# Altium project SealHAT.PrjPcb
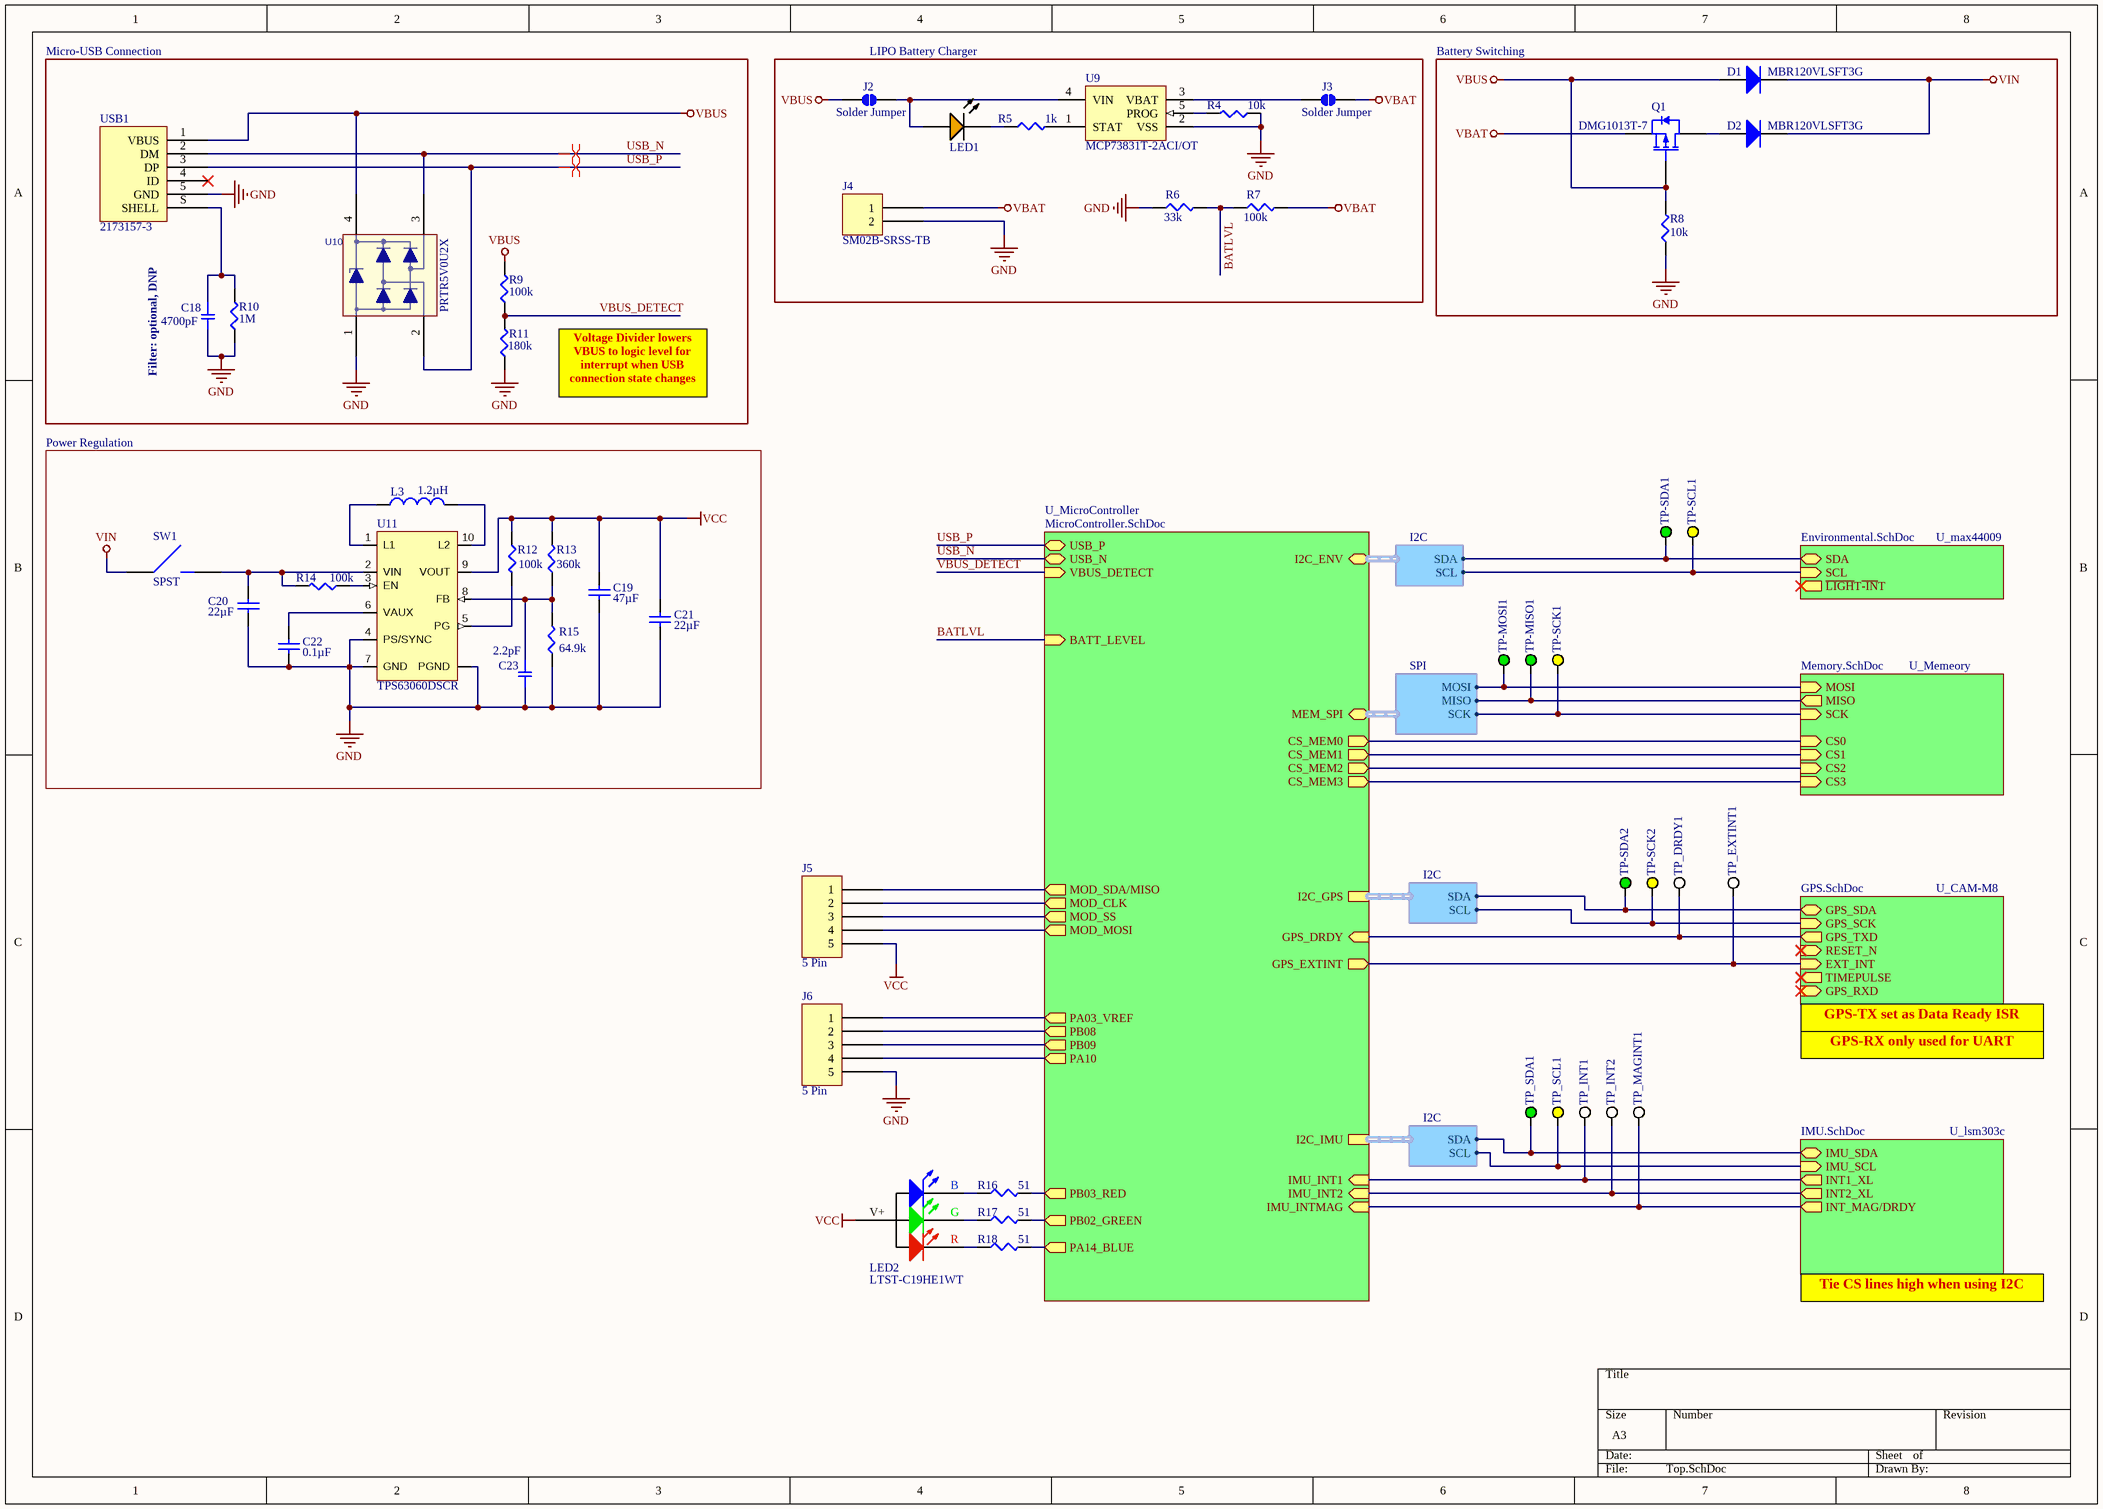
[diagram p0: Top.SchDoc]
6 sheets, 95 parts. Net scope: hierarchical (ports join the sheet entries above them; power ports are global).
Sheets:
  Top.SchDoc
    U_max44009 = Environmental.SchDoc
    U_CAM-M8 = GPS.SchDoc
    U_Memeory = Memory.SchDoc
    U_lsm303c = IMU.SchDoc
    U_MicroController = MicroController.SchDoc

## Sheet Top.SchDoc
size A3

### Parts
C18  value 4700pF  [SMD-0603C]  (hidden comment: GCM188R72A472KA37D)
C19  Capacitance: 47µF  [C0603N]  (hidden comment: CL21A476MQCLRNC)
C20  Capacitance: 22µF  [C0603N]  (hidden comment: CL21A226MQCLQNC)
C21  Capacitance: 22µF  [C0603N]  (hidden comment: CL21A226MQCLQNC)
C22  Capacitance: 0.1µF  [C0603N]  (hidden comment: CL10B104KO8NFNC)
C23  value 2.2pF  [SMD-0603C]  (hidden comment: GRM1885C1H2R2BA01D)
D1  MBR120VLSFT3G  [MBR120VLSFT3G]
D2  MBR120VLSFT3G  [MBR120VLSFT3G]
J2  Solder Jumper  [Jumper_1.5x3]
J3  Solder Jumper  [Jumper_1.5x3]
J4  SM02B-SRSS-TB  [JST SM02B-SRSS-TB]
J5  5 Pin  [PINHEAD127_1x5]
J6  5 Pin  [PINHEAD127_1x5]
L3  Inductance: 1.2µH  [IND_BOURNS_SRP40]  (hidden comment: SRP4020-1R2M)
LED1  LTST-C190KFKT  [LED_0603]  (value not drawn)
LED2  LTST-C19HE1WT  [LED_0606_160X160X35]
Q1  DMG1013T-7  [SOT50P175X90-3N]
R4  value 10k  [SMD-0603-RES]  (hidden comment: ERJ-3EKF1002V)
R5  value 1k  [SMD-0603-RES]  (hidden comment: ERJ-3EKF1001V)
R6  value 33k  [SMD-0603-RES]  (hidden comment: ERJ-3EKF3302V)
R7  value 100k  [SMD-0603-RES]  (hidden comment: ERJ-3EKF1003V)
R8  value 10k  [SMD-0603-RES]  (hidden comment: ERJ-3EKF1002V)
R9  value 100k  [SMD-0603-RES]  (hidden comment: ERJ-3EKF1003V)
R10  value 1M  [SMD-0603-RES]  (hidden comment: ERJ-3EKF1004V)
R11  value 180k  [SMD-0603-RES]  (hidden comment: ERJ-3EKF1803V)
R12  value 100k  [R0603N]  (hidden comment: ERJ-3EKF1003V)
R13  value 360k  [SMD-0603-RES]  (hidden comment: ERJ-3EKF3603V)
R14  value 100k  [R0603N]  (hidden comment: ERJ-3EKF1003V)
R15  value 64.9k  [SMD-0603-RES]  (hidden comment: ERJ-3EKF6492V)
R16  value 51  [SMD-0603-RES]  (hidden comment: ERJ-3EKF51R0V)
R17  value 51  [SMD-0603-RES]  (hidden comment: ERJ-3EKF51R0V)
R18  value 51  [SMD-0603-RES]  (hidden comment: ERJ-3EKF51R0V)
SW1  SPST  [PINHEAD254_1x2]
TP-MISO1  Test Point  [tp_30mil]  (value not drawn)
TP-MOSI1  Test Point  [tp_30mil]  (value not drawn)
TP-SCK1  Test Point  [tp_30mil]  (value not drawn)
TP-SCK2  Test Point  [tp_30mil]  (value not drawn)
TP-SCL1  Test Point  [tp_30mil]  (value not drawn)
TP-SDA1  Test Point  [tp_30mil]  (value not drawn)
TP-SDA2  Test Point  [tp_30mil]  (value not drawn)
TP_DRDY1  Test Point  [tp_30mil]  (value not drawn)
TP_EXTINT1  Test Point  [tp_30mil]  (value not drawn)
TP_INT1  Test Point  [tp_30mil]  (value not drawn)
TP_INT2  Test Point  [tp_30mil]  (value not drawn)
TP_MAGINT1  Test Point  [tp_30mil]  (value not drawn)
TP_SCL1  Test Point  [tp_30mil]  (value not drawn)
TP_SDA1  Test Point  [tp_30mil]  (value not drawn)
U9  MCP73831T-2ACI/OT  [SOT-23-5_MC]
U10  PRTR5V0U2X  [SOT143B]
U11  TPS63060DSCR  [TI_DRC_S-PVSON-N10]
USB1  2173157-3  [CONN_2173157]

### Blocks framed on the sheet
LIPO Battery Charger: J2-J4 LED1 R4-R7 U9
Battery Switching: D1 D2 Q1 R8
Power Regulation: C19-C23 L3 R12-R15 SW1 U11

### Sub-sheets
U_CAM-M8 = GPS.SchDoc: GPS_SCK (in), GPS_SDA (bidir), EXT_INT (in), TIMEPULSE (out), GPS_RXD (in), GPS_TXD (out), RESET_N (in)
U_lsm303c = IMU.SchDoc: IMU_SCL (in), IMU_SDA (bidir), INT1_XL (out), INT_MAG/DRDY (out), INT2_XL (out)
U_max44009 = Environmental.SchDoc: SDA (bidir), SCL (in), ~{LIGH}T~{-IN}T (out)
U_Memeory = Memory.SchDoc: MISO (out), SCK (in), MOSI (in), CS3 (in), CS1 (in), CS2 (in), CS0 (in)
U_MicroController = MicroController.SchDoc: USB_P (bidir), USB_N (bidir), I2C_GPS (harness I2C), VBUS_DETECT (in), BATT_LEVEL (in), GPS_DRDY (in), GPS_EXTINT (out), I2C_IMU (harness I2C), IMU_INT1 (in), IMU_INT2 (in), IMU_INTMAG (in), I2C_ENV (harness I2C), PB03_RED (out), PB02_GREEN (out), MEM_SPI (harness SPI), PA14_BLUE (out), PA10 (out), PA03_VREF (out), MOD_CLK (out), PB08 (out), MOD_MOSI (out), MOD_SS (out), PB09 (out), MOD_SDA/MISO (out), CS_MEM2 (out), CS_MEM1 (out), CS_MEM3 (out), CS_MEM0 (out)

### Harnesses
SPI: MOSI, MISO, SCK
I2C: SCL, SDA

### Nets
GND: C18.2 C19.2 C20.2 C21.2 C22.2 C23.2 J4.2 J6.5 R4.1 R6.1 R8.1 R10.1 R11.1 R15.1 U9.2(VSS) U10.1(GND) U11.4(PS/SYNC) U11.7(GND) U11.11(PGND) USB1.5(GND)
VBAT: J3.2 J4.1 Q1.2(S) R7.2
VBUS: D1.1(A) J2.1 Q1.1(G) R8.2 R9.2 U10.4(VCC) USB1.1(VBUS)
VCC: C19.1 C21.1 J5.5 LED2.4(A) R12.1 R13.2 U11.9(VOUT)
VIN: D1.2(K) D2.2(K) SW1.1
BATLVL: R6.2 R7.1 ; sheet U_MicroController/BATT_LEVEL
MISO: TP-MISO1.1 ; sheet U_Memeory/MISO, sheet U_MicroController/MEM_SPI.MISO
MOSI: TP-MOSI1.1 ; sheet U_Memeory/MOSI, sheet U_MicroController/MEM_SPI.MOSI
PA03_VREFA: J6.1 ; sheet U_MicroController/PA03_VREF
PA04_MOD_SDA: J5.1 ; sheet U_MicroController/MOD_SDA/MISO
PA05_MOD_SCL: J5.2 ; sheet U_MicroController/MOD_CLK
PA06_MOD_SS: J5.3 ; sheet U_MicroController/MOD_SS
PA07_MOD_MOSI: J5.4 ; sheet U_MicroController/MOD_MOSI
PA08_ENV_SDA: TP-SDA1.1 ; sheet U_max44009/SDA, sheet U_MicroController/I2C_ENV.SDA
PA09_ENV_SCL: TP-SCL1.1 ; sheet U_max44009/SCL, sheet U_MicroController/I2C_ENV.SCL
PA10_MOD3: J6.4 ; sheet U_MicroController/PA10
PA11_CSMEM3: sheet U_Memeory/CS3, sheet U_MicroController/CS_MEM3
PA13_MEM_SCK: TP-SCK1.1 ; sheet U_Memeory/SCK, sheet U_MicroController/MEM_SPI.SCK
PA14_CSMEM2: sheet U_Memeory/CS2, sheet U_MicroController/CS_MEM2
PA16_GPS_SDA: TP-SDA2.1 ; sheet U_CAM-M8/GPS_SDA, sheet U_MicroController/I2C_GPS.SDA
PA17_GPS_SCK: TP-SCK2.1 ; sheet U_CAM-M8/GPS_SCK, sheet U_MicroController/I2C_GPS.SCL
PA19_GPS_TXD: TP_DRDY1.1 ; sheet U_CAM-M8/GPS_TXD, sheet U_MicroController/GPS_DRDY
PA20_IMU_INT1: TP_INT1.1 ; sheet U_lsm303c/INT1_XL, sheet U_MicroController/IMU_INT1
PA21_IMU_INT2: TP_INT2.1 ; sheet U_lsm303c/INT2_XL, sheet U_MicroController/IMU_INT2
PA22_IMU_SDA: TP_SDA1.1 ; sheet U_lsm303c/IMU_SDA, sheet U_MicroController/I2C_IMU.SDA
PA23_IMU_SCL: TP_SCL1.1 ; sheet U_lsm303c/IMU_SCL, sheet U_MicroController/I2C_IMU.SCL
PA27_IMU_INTMAG: TP_MAGINT1.1 ; sheet U_lsm303c/INT_MAG/DRDY, sheet U_MicroController/IMU_INTMAG
PB02_GREEN: R17.2 ; sheet U_MicroController/PB02_GREEN
PB03_RED: R16.2 ; sheet U_MicroController/PB03_RED
PB08_MOD1: J6.2 ; sheet U_MicroController/PB08
PB09_MOD2: J6.3 ; sheet U_MicroController/PB09
PB10_CSMEM0: sheet U_Memeory/CS0, sheet U_MicroController/CS_MEM0
PB11_CSMEM1: sheet U_Memeory/CS1, sheet U_MicroController/CS_MEM1
PB22_GPS_EXTINT: TP_EXTINT1.1 ; sheet U_CAM-M8/EXT_INT, sheet U_MicroController/GPS_EXTINT
PB23_BLUE: R18.2 ; sheet U_MicroController/PA14_BLUE
USB_N: U10.3(I/O2) USB1.2(DM) ; sheet U_MicroController/USB_N
USB_P: U10.2(I/O1) USB1.3(DP) ; sheet U_MicroController/USB_P
VBUS_DETECT: R9.1 R11.2 ; sheet U_MicroController/VBUS_DETECT  [project net PA18_VBUS_DETECT]
NetC18_1: C18.1 R10.2 USB1.S(SHELL)
NetC20_1: C20.1 R14.2 SW1.2 U11.2(VIN)
NetC22_1: C22.1 U11.6(VAUX)
NetC23_1: C23.1 R13.1 R15.2 U11.8(FB)
NetD2_1: D2.1(A) Q1.3(D)
NetJ2_2: J2.2 LED1.1(A) U9.4(VIN)
NetJ3_1: J3.1 U9.3(VBAT)
NetL3_1: L3.1 U11.1(L1)
NetL3_2: L3.2 U11.10(L2)
NetLED1_2: LED1.2(K) R5.1
NetLED2_1: LED2.1(R) R18.1
NetLED2_2: LED2.2(G) R17.1
NetLED2_3: LED2.3(B) R16.1
NetR4_2: R4.2 U9.5(PROG)
NetR5_2: R5.2 U9.1(STAT)
NetR12_2: R12.2 U11.5(PG)
NetR14_1: R14.1 U11.3(EN)

Not connected (* = marked no-connect by the designer): USB1 4(ID)*

### Layout directives
differential pair: USB_N, USB_P

### Notes on the sheet
- Micro-USB Connection
- Filter: optional, DNP
- Voltage Divider lowers VBUS to logic level for interrupt when USB connection state changes
- GPS-RX only used for UART
- GPS-TX set as Data Ready ISR
- Tie CS lines high when using I2C
- (in symbol LTST-C19HE1WT) V+

### Library data of the parts
C18 = GCM188R72A472KA37D: CAP CER 4700PF 100V X7R 0603; Manufacturer: Murata Electronics North America; Factory Stock: 0; Unit Price (USD): 0.1; Minimum Quantity: 1; Tolerance: ±10%; Datasheets: http://www.murata.com/~/media/webrenewal/support/library/catalog/products/capacitor/mlcc/c03e.ashx; Image: //media.digikey.com/Renders/Murata%20Renders/0603%28GCM188%29.jpg; Digi-Key Part Number: 490-4930-1-ND; Part Number: GCM188R72A472KA37D; Quantity Available: 3550; @ qty: 0; Packaging: Cut Tape (CT); Series: GCM; Part Status: Active; Voltage: 100V; Temperature Coefficient: X7R; Operating Temperature: -55°C ~ 125°C; Features: -; Ratings: AEC-Q200; Applications: Automotive; Mounting Type: Surface Mount, MLCC; Package / Case: 0603 (1608 Metric); Size / Dimension: 0.063" L x 0.031" W (1.60mm x 0.80mm); Height - Seated (Max): -; Thickness (Max): 0.035" (0.90mm); Lead Spacing: -; Lead Style: -
C19-C21 = CAPACITOR_NP: HOUSEPART: NO; POPULATE: 1; TOLERANCE: ±20%; VOLTAGE: 6.3V; Temperature Coefficient: X5R; LibraryName: MF_Passives; DeviceSetName: CAPACITOR_NP
  C19: DeviceName: CL21A476MQCLRNC; MPN: CL21A476MQCLRNC; URL: https://octopart.com/cl21a476mqclrnc-samsung-24871259; MF_PARTNUM: CL21A476MQCLRNC
  C20: DeviceName: CL21A226MQCLQNC; MPN: CL21A226MQCLQNC; URL: https://octopart.com/cl21a226mqclqnc-samsung-19832203; MF_PARTNUM: CL21A226MQCLQNC
  C21: DeviceName: CL21A226MQCLQNC; MPN: CL21A226MQCLQNC; URL: https://octopart.com/cl21a476mqclrnc-samsung-24871259; MF_PARTNUM: CL21A226MQCLQNC
C22 = CAPACITOR_NP: HOUSEPART: NO; POPULATE: 1; TOLERANCE: ±10%; VOLTAGE: 16V; Temperature Coefficient: X7R; DeviceName: CL10B104KO8NFNC; LibraryName: MF_Passives; DeviceSetName: CAPACITOR_NP; MPN: CL10B104KO8NFNC; URL: https://octopart.com/cl10b104ko8nfnc-samsung-19831587; MF_PARTNUM: CL10B104KO8NFNC
C23 = GRM1885C1H2R2BA01D: CAP CER 2.2PF 50V NP0 0603; Manufacturer: Murata Electronics North America; Factory Stock: 0; Unit Price (USD): 0.11; Minimum Quantity: 1; Tolerance: ±0.1pF; Temperature Coefficient: C0G, NP0; Datasheets: http://www.murata.com/~/media/webrenewal/support/library/catalog/products/capacitor/mlcc/c02e.pdf; Image: //media.digikey.com/Renders/Murata%20Renders/ZRB-SERIES-0402.jpg; Digi-Key Part Number: 490-12719-1-ND; Part Number: GRM1885C1H2R2BA01D; Quantity Available: 2033; @ qty: 0; Packaging: Cut Tape (CT); Series: GRM; Part Status: Active; Voltage: 50V; Operating Temperature: -55°C ~ 125°C; Features: -; Ratings: -; Applications: General Purpose; Mounting Type: Surface Mount, MLCC; Package / Case: 0603 (1608 Metric); Size / Dimension: 0.063" L x 0.031" W (1.60mm x 0.80mm); Height - Seated (Max): -; Thickness (Max): 0.035" (0.90mm); Lead Spacing: -; Lead Style: -
D1 D2 = MBR120VLSFT3G: Diode Schottky 20V 1A Surface Mount SOD-123FL; Manufacturer Part Number: MBR120VLSFT3G
J2 J3 = solderJumper
J4 = 2 Pin: Part Number: SM02B-SRSS-TB
L3 = SRP4020-1R2M: C: Copyright (C) 2015 Accelerated Designs. All rights reserved; Vendor: Bourns Electronics; Built_By: EMA_UL_Team; Type: Wirewound; Tolerance: ±20%; Current Rating: 5A; DC Resistance (DCR): 22 mOhm Max; Inductance Frequency - Test: 100kHz; Manufacturer Part Number: SRP4020-1R2M
LED1 = CMP-1544850-3: LED Uni-Color Orange, 75 mW, 30 mA; Forward Voltage: 2.00 V; Luminous Intensity: 60.0 mcd; Lens Type: Non-Diffused; Wavelength: 611 nm; Viewing Angle: 130 °; Lead-Free Status: Lead Free; Case/Package (SI): 1608; Size-Width: 800 µm; PackageReference: C190KFKT; Size-Height: 800 µm; Color: Orange; Packaging: Cut Tape (CT), Tape & Reel (TR); RoHS: Compliant; Seller Landing  Url: https://octopart-clicks.com/click/track?country=US&ak=8157f166&sig=0e2a9b5&sid=459&ppid=549896&vpid=1324662&ct=offers; Octopart Url: http://octopart.com/ltst-c190kfkt-lite-on-549896; Mounting Style: Surface Mount, Vertical; OctopartID: 99ca50c8d8a4460d; DatasheetVersion: Rev. I, 09/2011; Manufacturer Part Number: LTST-C190KFKT; Case/Package: 0603; Size-Length: 1.60 mm; PackageDescription: 2-Pin Surface Mount Device, Body 1.6 x 0.8 mm
LED2 = LTST-C19HE1WT: RGB LED 0606 (1616 metric); Lead-Free Status: Lead Free; Wavelength - Dominant: 624nm Red, 525nm Green, 470nm Blue; package metric: 1616; Configuration: Common Anode; Octopart URL: http://octopart.com/ltst-c19he1wt-lite-on-13128904; OctopartID: 1946d08468e8c681; RoHS: Compliant; Manufacturer Part Number: LTST-C19HE1WT; package: 0606; supplier 1: Digikey; Supplier Part Number: 160-2162-1-ND; Height (Max): 0.45mm; Mounting Type: SMT
Q1 = DMG1013T-7c2930a883c7b1d54: P-Channel SOT-523; Lead-Free Status: Lead Free; RoHS: Compliant; Lifecycle Status: Active; Polarity: P-Channel; Manufacturer Part Number: DMG1013T-7; REACH SVHC Compliance: No SVHC; Octopart URL: http://octopart.com/dmg1013t-7-diodes+inc.-17947534; OctopartID: c2930a883c7b1d54
R4 R8 = ERJ-3EKF1002V: RES SMD 10K OHM 1% 1/10W 0603; Manufacturer: Panasonic Electronic Components; Factory Stock: 0; Unit Price (USD): 0.00379; @ qty: 1500; Minimum Quantity: 1; Power (Watts): 0.1W, 1/10W; Temperature Coefficient: ±100ppm/°C; Part Number: ERJ-3EKF1002V; Datasheets: http://industrial.panasonic.com/www-cgi/jvcr13pz.cgi?E+PZ+3+AOA0002+ERJ3EKF1002V+7+WW; Image: //media.digikey.com/Photos/Panasonic%20Photos/MFG_ERJ-P6W%20Series.jpg; Digi-Key Part Number: P10.0KHCT-ND; Quantity Available: 6703141; Packaging: Cut Tape (CT); Series: ERJ; Part Status: Active; Tolerance: ±1%; Composition: Thick Film; Features: Automotive AEC-Q200; Operating Temperature: -55°C ~ 155°C; Package / Case: 0603 (1608 Metric); Supplier Device Package: 0603; Size / Dimension: 0.063" L x 0.031" W (1.60mm x 0.80mm); Height - Seated (Max): 0.022" (0.55mm); Number of Terminations: 2; Failure Rate: -
R5 = ERJ-3EKF1001V: RES SMD 1K OHM 1% 1/10W 0603; Manufacturer: Panasonic Electronic Components; Factory Stock: 0; Unit Price (USD): 0.00379; @ qty: 1500; Minimum Quantity: 1; Power (Watts): 0.1W, 1/10W; Temperature Coefficient: ±100ppm/°C; Part Number: ERJ-3EKF1001V; Datasheets: http://industrial.panasonic.com/www-cgi/jvcr13pz.cgi?E+PZ+3+AOA0002+ERJ3EKF1001V+7+WW; Image: //media.digikey.com/Photos/Panasonic%20Photos/MFG_ERJ-P6W%20Series.jpg; Digi-Key Part Number: P1.00KHCT-ND; Quantity Available: 5218845; Packaging: Cut Tape (CT); Series: ERJ; Part Status: Active; Tolerance: ±1%; Composition: Thick Film; Features: Automotive AEC-Q200; Operating Temperature: -55°C ~ 155°C; Package / Case: 0603 (1608 Metric); Supplier Device Package: 0603; Size / Dimension: 0.063" L x 0.031" W (1.60mm x 0.80mm); Height - Seated (Max): 0.022" (0.55mm); Number of Terminations: 2; Failure Rate: -
R6 = ERJ-3EKF3302V: RES SMD 33K OHM 1% 1/10W 0603; Manufacturer: Panasonic Electronic Components; Factory Stock: 0; Unit Price (USD): 0.00379; @ qty: 1500; Minimum Quantity: 1; Power (Watts): 0.1W, 1/10W; Temperature Coefficient: ±100ppm/°C; Part Number: ERJ-3EKF3302V; Datasheets: http://industrial.panasonic.com/www-cgi/jvcr13pz.cgi?E+PZ+3+AOA0002+ERJ3EKF3302V+7+WW; Image: //media.digikey.com/Photos/Panasonic%20Photos/MFG_ERJ-P6W%20Series.jpg; Digi-Key Part Number: P33.0KHCT-ND; Quantity Available: 240194; Packaging: Cut Tape (CT); Series: ERJ; Part Status: Active; Tolerance: ±1%; Composition: Thick Film; Features: Automotive AEC-Q200; Operating Temperature: -55°C ~ 155°C; Package / Case: 0603 (1608 Metric); Supplier Device Package: 0603; Size / Dimension: 0.063" L x 0.031" W (1.60mm x 0.80mm); Height - Seated (Max): 0.022" (0.55mm); Number of Terminations: 2; Failure Rate: -
R7 R9 R12 R14 = ERJ-3EKF1003V: RES SMD 100K OHM 1% 1/10W 0603; Manufacturer: Panasonic Electronic Components; Factory Stock: 0; Unit Price (USD): 0.00379; @ qty: 1500; Minimum Quantity: 1; Power (Watts): 0.1W, 1/10W; Temperature Coefficient: ±100ppm/°C; Part Number: ERJ-3EKF1003V; Datasheets: http://industrial.panasonic.com/www-cgi/jvcr13pz.cgi?E+PZ+3+AOA0002+ERJ3EKF1003V+7+WW; Image: //media.digikey.com/Photos/Panasonic%20Photos/MFG_ERJ-P6W%20Series.jpg; Digi-Key Part Number: P100KHCT-ND; Quantity Available: 2179804; Packaging: Cut Tape (CT); Series: ERJ; Part Status: Active; Tolerance: ±1%; Composition: Thick Film; Features: Automotive AEC-Q200; Operating Temperature: -55°C ~ 155°C; Package / Case: 0603 (1608 Metric); Supplier Device Package: 0603; Size / Dimension: 0.063" L x 0.031" W (1.60mm x 0.80mm); Height - Seated (Max): 0.022" (0.55mm); Number of Terminations: 2; Failure Rate: -
R10 = ERJ-3EKF1004V: RES SMD 1M OHM 1% 1/10W 0603; Manufacturer: Panasonic Electronic Components; Factory Stock: 0; Unit Price (USD): 0.00379; @ qty: 1500; Minimum Quantity: 1; Power (Watts): 0.1W, 1/10W; Temperature Coefficient: ±100ppm/°C; Part Number: ERJ-3EKF1004V; Datasheets: http://industrial.panasonic.com/www-cgi/jvcr13pz.cgi?E+PZ+3+AOA0002+ERJ3EKF1004V+7+WW; Image: //media.digikey.com/Photos/Panasonic%20Photos/MFG_ERJ-P6W%20Series.jpg; Digi-Key Part Number: P1.00MHCT-ND; Quantity Available: 1632074; Packaging: Cut Tape (CT); Series: ERJ; Part Status: Active; Tolerance: ±1%; Composition: Thick Film; Features: Automotive AEC-Q200; Operating Temperature: -55°C ~ 155°C; Package / Case: 0603 (1608 Metric); Supplier Device Package: 0603; Size / Dimension: 0.063" L x 0.031" W (1.60mm x 0.80mm); Height - Seated (Max): 0.022" (0.55mm); Number of Terminations: 2; Failure Rate: -
R11 = ERJ-3EKF1803V: RES SMD 180K OHM 1% 1/10W 0603; Manufacturer: Panasonic Electronic Components; Factory Stock: 0; Unit Price (USD): 0.00379; @ qty: 1500; Minimum Quantity: 1; Power (Watts): 0.1W, 1/10W; Temperature Coefficient: ±100ppm/°C; Part Number: ERJ-3EKF1803V; Datasheets: http://industrial.panasonic.com/www-cgi/jvcr13pz.cgi?E+PZ+3+AOA0002+ERJ3EKF1803V+7+WW; Image: //media.digikey.com/Photos/Panasonic%20Photos/MFG_ERJ-P6W%20Series.jpg; Digi-Key Part Number: P180KHCT-ND; Quantity Available: 74867; Packaging: Cut Tape (CT); Series: ERJ; Part Status: Active; Tolerance: ±1%; Composition: Thick Film; Features: Automotive AEC-Q200; Operating Temperature: -55°C ~ 155°C; Package / Case: 0603 (1608 Metric); Supplier Device Package: 0603; Size / Dimension: 0.063" L x 0.031" W (1.60mm x 0.80mm); Height - Seated (Max): 0.022" (0.55mm); Number of Terminations: 2; Failure Rate: -
R13 = ERJ-3EKF3603V: RES SMD 360K OHM 1% 1/10W 0603; Manufacturer: Panasonic Electronic Components; Factory Stock: 0; Unit Price (USD): 0.00379; @ qty: 1500; Minimum Quantity: 1; Power (Watts): 0.1W, 1/10W; Temperature Coefficient: ±100ppm/°C; Part Number: ERJ-3EKF3603V; Datasheets: http://industrial.panasonic.com/www-cgi/jvcr13pz.cgi?E+PZ+3+AOA0002+ERJ3EKF3603V+7+WW; Image: //media.digikey.com/Photos/Panasonic%20Photos/MFG_ERJ-P6W%20Series.jpg; Digi-Key Part Number: P360KHCT-ND; Quantity Available: 34696; Packaging: Cut Tape (CT); Series: ERJ; Part Status: Active; Tolerance: ±1%; Composition: Thick Film; Features: Automotive AEC-Q200; Operating Temperature: -55°C ~ 155°C; Package / Case: 0603 (1608 Metric); Supplier Device Package: 0603; Size / Dimension: 0.063" L x 0.031" W (1.60mm x 0.80mm); Height - Seated (Max): 0.022" (0.55mm); Number of Terminations: 2; Failure Rate: -
R15 = ERJ-3EKF6492V: RES SMD 64.9K OHM 1% 1/10W 0603; Manufacturer: Panasonic Electronic Components; Factory Stock: 0; Unit Price (USD): 0.00379; @ qty: 1500; Minimum Quantity: 1; Power (Watts): 0.1W, 1/10W; Temperature Coefficient: ±100ppm/°C; Part Number: ERJ-3EKF6492V; Datasheets: http://industrial.panasonic.com/www-cgi/jvcr13pz.cgi?E+PZ+3+AOA0002+ERJ3EKF6492V+7+WW; Image: //media.digikey.com/Photos/Panasonic%20Photos/MFG_ERJ-P6W%20Series.jpg; Digi-Key Part Number: P64.9KHCT-ND; Quantity Available: 58875; Packaging: Cut Tape (CT); Series: ERJ; Part Status: Active; Tolerance: ±1%; Composition: Thick Film; Features: Automotive AEC-Q200; Operating Temperature: -55°C ~ 155°C; Package / Case: 0603 (1608 Metric); Supplier Device Package: 0603; Size / Dimension: 0.063" L x 0.031" W (1.60mm x 0.80mm); Height - Seated (Max): 0.022" (0.55mm); Number of Terminations: 2; Failure Rate: -
R16-R18 = ERJ-3EKF51R0V: RES SMD 51 OHM 1% 1/10W 0603; Manufacturer: Panasonic Electronic Components; Factory Stock: 0; Unit Price (USD): 0.00379; @ qty: 1500; Minimum Quantity: 1; Power (Watts): 0.1W, 1/10W; Temperature Coefficient: ±100ppm/°C; Part Number: ERJ-3EKF51R0V; Datasheets: http://industrial.panasonic.com/www-cgi/jvcr13pz.cgi?E+PZ+3+AOA0002+ERJ3EKF51R0V+7+WW; Image: //media.digikey.com/Photos/Panasonic%20Photos/MFG_ERJ-P6W%20Series.jpg; Digi-Key Part Number: P51.0HCT-ND; Quantity Available: 129747; Packaging: Cut Tape (CT); Series: ERJ; Part Status: Active; Tolerance: ±1%; Composition: Thick Film; Features: Automotive AEC-Q200; Operating Temperature: -55°C ~ 155°C; Package / Case: 0603 (1608 Metric); Supplier Device Package: 0603; Size / Dimension: 0.063" L x 0.031" W (1.60mm x 0.80mm); Height - Seated (Max): 0.022" (0.55mm); Number of Terminations: 2; Failure Rate: -
SW1 = SPST switch
TP-MISO1 TP-MOSI1 TP-SDA1 TP-SDA2 TP_SDA1 = testpoint_green: Test Point Green
TP-SCK1 TP-SCK2 TP-SCL1 TP_SCL1 = testpoint_yellow: Test Point Yellow
TP_DRDY1 TP_EXTINT1 TP_INT1 TP_INT2 TP_MAGINT1 = testpoint_white: Test Point White
U9 = MCHP-MCP73831T-5: MCP73831 Series Single-Cell Li-Ion/Li-Polymer Battery Charge Controller SOT-23-5; Input Voltage (DC): 3.75 V (min); Lead-Free Status: Lead Free; Supply Voltage (DC): 6.00 V (max); Output Voltage: 7.30 V; RoHS: Compliant; Octopart URL: https://octopart-clicks.com/click/track?country=US&ak=8157f166&sig=05342b1&sid=459&ppid=55392281&vpid=188043932&ct=offers; OctopartID: d79a1dddcae5085d; Manufacturer Part Number: MCP73831T-2ACI/OT; REACH SVHC Compliance: No SVHC; Case/Package: SOT-23; Lifecycle Status: Active; Packaging: Cut Tape (CT), Tape & Reel (TR); Number of Pins: 5; Mounting Style: Surface Mount; Octopart Url: http://octopart.com/mcp73831t-2aci%2Fot-microchip-55392281
U10 = PRTR5V0U2X: C: Copyright (C) 2015 Accelerated Designs. All rights reserved; Vendor: NXP; Built_By: EMA_UL_Team; Value: PRTR5V0U2X; Manufacturer_Part_Number: PRTR5V0U2X
U11 = TPS63060DSCR: 2.5V to 12V input voltage, 93% Efficient, 2.25A Switch Current Limit, Buck-Boost Converter 10-WSON -40 to 85; Manufacturer Part Number: TPS63060DSCR
USB1 = USB-CONN-2173157-3: Conn Micro USB 2.0 Type B Splash Proof; Lead-Free Status: Lead Free; ELV Compliant: Compliant; Gender: Female; Packaging: Tape & Reel (TR); Manufacturer Part Number: 2173157-3; Contact Plating: Gold; RoHS: Compliant; Octopart URL: https://octopart.com/2173157-3-te+connectivity-34977340; Housing Color: Black; Housing Material: Thermoplastic; Mounting Style: Surface Mount, Solder; Operating Temperature: -30.0 °C to 85.0 °C; Lifecycle Status: Not Listed by Manufacturer; OctopartID: 8f71446e1c2b50b6; Supplier Part Number: A124356CT-ND; Supplier 1: Digikey

## Sheet Environmental.SchDoc
size A4
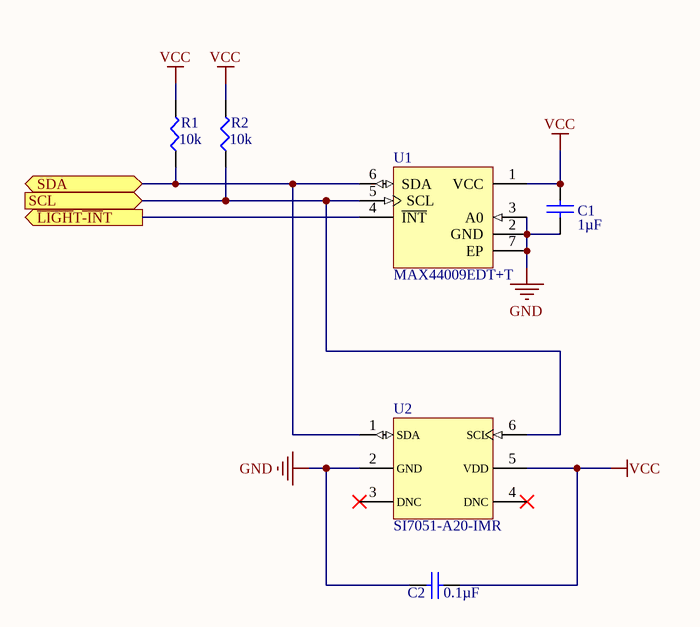
[diagram p1: Environmental.SchDoc]

### Parts
C1  Capacitance: 1µF  [C0603N]  (hidden comment: CL10B105KP8NFNC)
C2  Capacitance: 0.1µF  [C0603N]  (hidden comment: CL10B104KO8NFNC)
R1  value 10k  [SMD-0603-RES]  (hidden comment: ERJ-3EKF1002V)
R2  value 10k  [SMD-0603-RES]  (hidden comment: ERJ-3EKF1002V)
U1  MAX44009EDT+T  [21-0490D]
U2  SI7051-A20-IMR  [si705x-hand]

### Ports
SCL (in), SDA (bidir), ~{LIGH}T~{-IN}T (out)

### Nets
GND: C1.1 C2.1 U1.2(GND) U1.3(A0) U1.7(EP) U2.2(GND)
VCC: C1.2 C2.2 R1.2 R2.2 U1.1(VCC) U2.5(VDD)
~{LIGH}T~{-IN}T: U1.4(~{INT}) ; port ~{LIGH}T~{-IN}T
PA08_ENV_SDA: R1.1 U1.6(SDA) U2.1(SDA) ; port SDA
PA09_ENV_SCL: R2.1 U1.5(SCL) U2.6(SCL) ; port SCL

Not connected (* = marked no-connect by the designer): U2 3(DNC)* 4(DNC)*

### Library data of the parts
C1 = CAPACITOR_NP: CAP CER 1UF 10V X7R 0603; HOUSEPART: NO; POPULATE: 1; TOLERANCE: ±10%; VOLTAGE: 16V; DeviceName: CL10B105KP8NFNC; LibraryName: MF_Passives; DeviceSetName: CAPACITOR_NP; MPN: CL10B105KP8NFNC; URL: https://octopart.com/cl10b104ko8nfnc-samsung-19831587; MF_PARTNUM: CL10B105KP8NFNC; Temperature Coefficient: X7R
C2 = CAPACITOR_NP: as C22 on sheet Top; DeviceName: CL10B104KO8NFNC; LibraryName: MF_Passives; DeviceSetName: CAPACITOR_NP; MPN: CL10B104KO8NFNC; URL: https://octopart.com/cl10b104ko8nfnc-samsung-19831587; MF_PARTNUM: CL10B104KO8NFNC
R1 R2 = ERJ-3EKF1002V: as R4 on sheet Top; Part Number: ERJ-3EKF1002V; Datasheets: http://industrial.panasonic.com/www-cgi/jvcr13pz.cgi?E+PZ+3+AOA0002+ERJ3EKF1002V+7+WW; Image: //media.digikey.com/Photos/Panasonic%20Photos/MFG_ERJ-P6W%20Series.jpg; Digi-Key Part Number: P10.0KHCT-ND; Quantity Available: 6703141; Packaging: Cut Tape (CT); Series: ERJ; Part Status: Active; Tolerance: ±1%; Composition: Thick Film; Features: Automotive AEC-Q200; Operating Temperature: -55°C ~ 155°C; Package / Case: 0603 (1608 Metric); Supplier Device Package: 0603; Size / Dimension: 0.063" L x 0.031" W (1.60mm x 0.80mm); Height - Seated (Max): 0.022" (0.55mm); Number of Terminations: 2; Failure Rate: -
U1 = MAX44009EDT+T: MAX44009 light sensor; Octopart Url: https://octopart.com/max44009edt%2Bt-maxim+integrated-44380498; Manufacturer Part Number: MAX44009EDT+T; Lifecycle Status: Active; OctopartID: e71f2cb0f32b38d8; Case/Package: 6-UDFN
U2 = CMP-6e6fa3261226b1a8-2: Temperature Sensor tal, Local -40°C ~ 125°C 14 b 6-DFN (3x3); Octopart URL: https://octopart.com/si7051-a20-im-silicon+labs-71522607; RoHS: Compliant; Case/Package: 6-DFN; Manufacturer Part Number: SI7051-A20-IMR

## Sheet GPS.SchDoc
size A
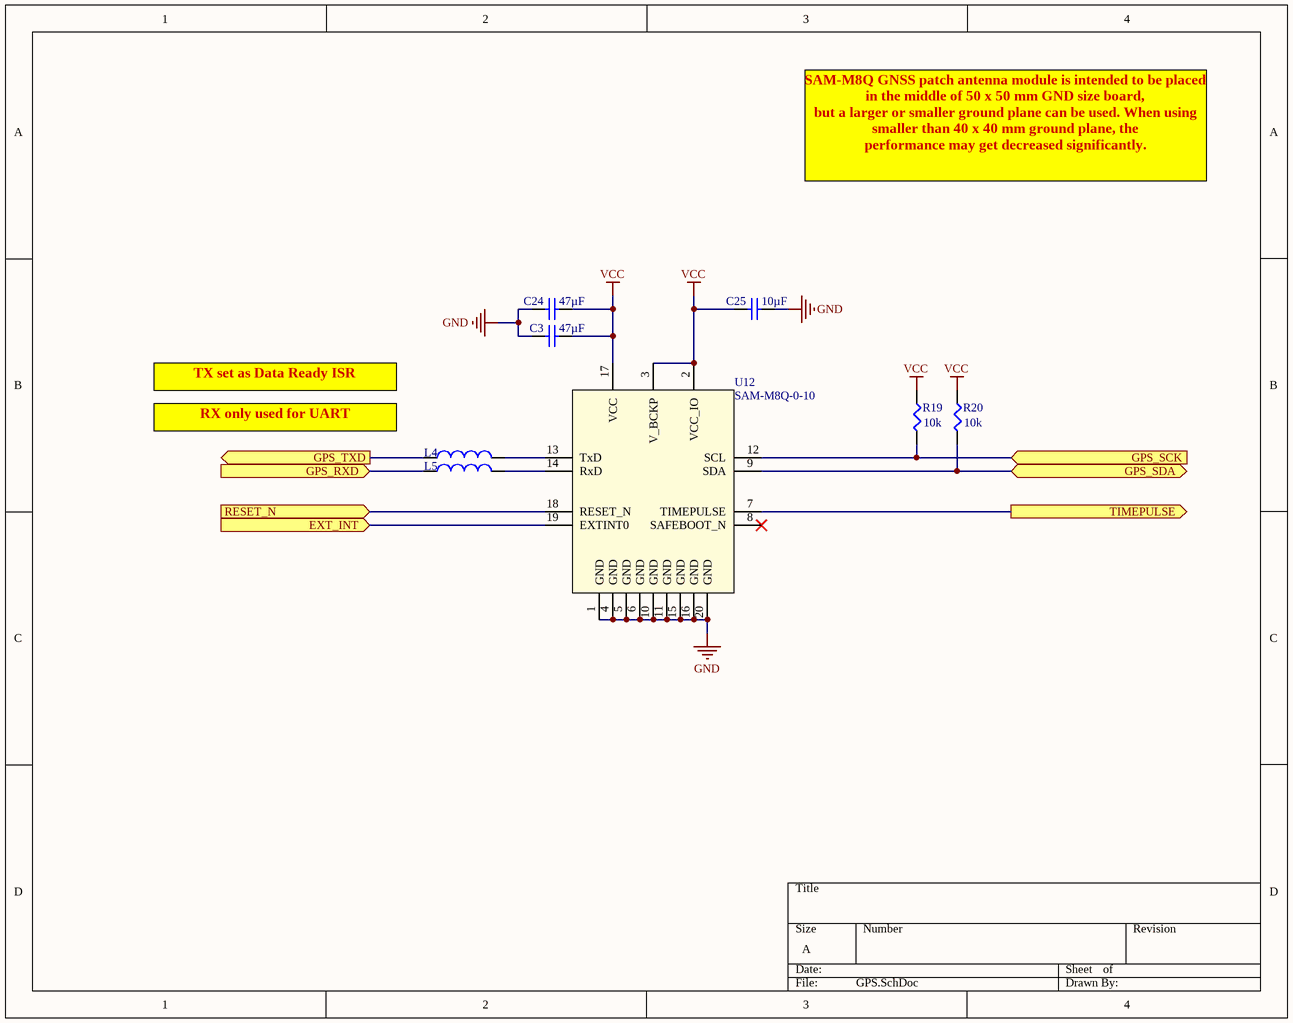
[diagram p2: GPS.SchDoc]

### Parts
C3  Capacitance: 47µF  [C0603N]  (hidden comment: CL21A476MQCLRNC)
C24  Capacitance: 47µF  [C0603N]  (hidden comment: CL21A476MQCLRNC)
C25  Capacitance: 10µF  [C0603N]  (hidden comment: C1608X5R1A106K080AC)
L4  LI0603G221R-10  [R0603L]  (value not drawn)
L5  LI0603G221R-10  [R0603L]  (value not drawn)
R19  value 10k  [SMD-0603-RES]  (hidden comment: ERJ-3EKF1002V)
R20  value 10k  [SMD-0603-RES]  (hidden comment: ERJ-3EKF1002V)
U12  SAM-M8Q-0-10  [SAM-M8Q]

### Ports
EXT_INT (in), GPS_RXD (in), GPS_SCK (in), GPS_SDA (bidir), GPS_TXD (out), RESET_N (in), TIMEPULSE (out)

### Nets
GND: C3.1 C24.1 C25.2 U12.1(GND) U12.4(GND) U12.5(GND) U12.6(GND) U12.10(GND) U12.11(GND) U12.15(GND) U12.16(GND) U12.20(GND)
VCC: C3.2 C24.2 C25.1 R19.1 R20.1 U12.2(VCC_IO) U12.3(V_BCKP) U12.17(VCC)
GPS_RXD: L5.1 ; port GPS_RXD
PA16_GPS_SDA: R20.2 U12.9(SDA) ; port GPS_SDA
PA17_GPS_SCK: R19.2 U12.12(SCL) ; port GPS_SCK
PA19_GPS_TXD: L4.1 ; port GPS_TXD
PB22_GPS_EXTINT: U12.19(EXTINT0) ; port EXT_INT
RESET_N: U12.18(RESET_N) ; port RESET_N
TIMEPULSE: U12.7(TIMEPULSE) ; port TIMEPULSE
NetL4_2: L4.2 U12.13(TxD)
NetL5_2: L5.2 U12.14(RxD)

Not connected (* = marked no-connect by the designer): U12 8(SAFEBOOT_N)*

### Notes on the sheet
- SAM‑M8Q GNSS patch antenna module is intended to be placed in the middle of 50 x 50 mm GND size board,
  but a larger or smaller ground plane can be used. When using smaller than 40 x 40 mm ground plane, the
  performance may get decreased significantly.
- RX only used for UART
- TX set as Data Ready ISR

### Library data of the parts
C3 C24 = CAPACITOR_NP: as C19 on sheet Top; DeviceName: CL21A476MQCLRNC; LibraryName: MF_Passives; DeviceSetName: CAPACITOR_NP; MPN: CL21A476MQCLRNC; URL: https://octopart.com/cl21a476mqclrnc-samsung-24871259; MF_PARTNUM: CL21A476MQCLRNC
C25 = CAPACITOR_NP: 4.7µF ±10% 10V Ceramic Capacitor X5R 0603; HOUSEPART: NO; POPULATE: 1; DeviceName: C1608X5R1A106K080AC; LibraryName: MF_Passives; DeviceSetName: CAPACITOR_NP; MPN: C1608X5R1A106K080AC; TOLERANCE: ±10%; VOLTAGE: 10V; MF_PARTNUM: C1608X5R1A106K080AC; Temperature Coefficient: X5R
L4 L5 = INDUCTOR: HOUSEPART: NO; POPULATE: 1; LibraryName: MF_Passives; DeviceSetName: INDUCTOR; MPN: LI0603G221R-10; URL: https://www.digikey.com/product-detail/en/laird-signal-integrity-products/LI0603G221R-10/240-2368-1-ND/806728
R19 R20 = ERJ-3EKF1002V: as R4 on sheet Top; Part Number: ERJ-3EKF1002V; Datasheets: http://industrial.panasonic.com/www-cgi/jvcr13pz.cgi?E+PZ+3+AOA0002+ERJ3EKF1002V+7+WW; Image: //media.digikey.com/Photos/Panasonic%20Photos/MFG_ERJ-P6W%20Series.jpg; Digi-Key Part Number: P10.0KHCT-ND; Quantity Available: 6703141; Packaging: Cut Tape (CT); Series: ERJ; Part Status: Active; Tolerance: ±1%; Composition: Thick Film; Features: Automotive AEC-Q200; Operating Temperature: -55°C ~ 155°C; Package / Case: 0603 (1608 Metric); Supplier Device Package: 0603; Size / Dimension: 0.063" L x 0.031" W (1.60mm x 0.80mm); Height - Seated (Max): 0.022" (0.55mm); Number of Terminations: 2; Failure Rate: -
U12 = ublox-sam-m8Q: u-Blox M8 Gnss Antenna Module Tc; Octopart URL: https://octopart.com/sam-m8q-0-10-u-blox-88247750; Manufacturer Part Number: SAM-M8Q-0-10; OctopartID: 87e74baf2f475820; Case/Package: SAM-M8Q

## Sheet Memory.SchDoc
size A4
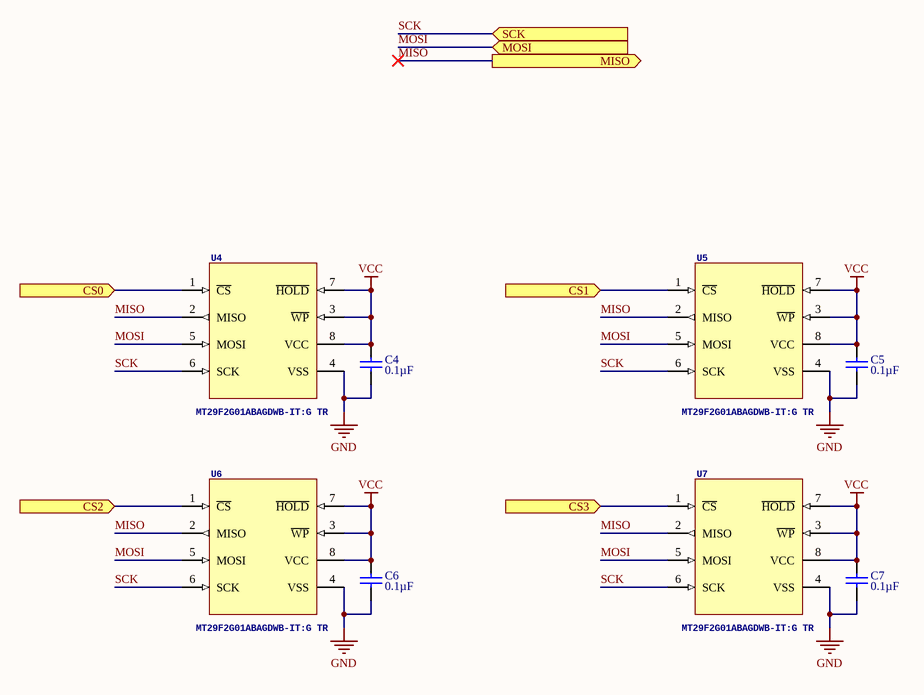
[diagram p3: Memory.SchDoc]

### Parts
C4  Capacitance: 0.1µF  [C0603N]  (hidden comment: CL10B104KO8NFNC)
C5  Capacitance: 0.1µF  [C0603N]  (hidden comment: CL10B104KO8NFNC)
C6  Capacitance: 0.1µF  [C0603N]  (hidden comment: CL10B104KO8NFNC)
C7  Capacitance: 0.1µF  [C0603N]  (hidden comment: CL10B104KO8NFNC)
U4  MT29F2G01ABAGDWB-IT:G TR  [8-UDFN-MT29F]
U5  MT29F2G01ABAGDWB-IT:G TR  [8-UDFN-MT29F]
U6  MT29F2G01ABAGDWB-IT:G TR  [8-UDFN-MT29F]
U7  MT29F2G01ABAGDWB-IT:G TR  [8-UDFN-MT29F]

### Ports
CS0 (in), CS1 (in), CS2 (in), CS3 (in), MISO (out), MOSI (in), SCK (in)

### Nets
GND: C4.2 C5.2 C6.2 C7.2 U4.4(VSS) U5.4(VSS) U6.4(VSS) U7.4(VSS)
VCC: C4.1 C5.1 C6.1 C7.1 U4.3(~{WP}) U4.7(~{HOLD}) U4.8(VCC) U5.3(~{WP}) U5.7(~{HOLD}) U5.8(VCC) U6.3(~{WP}) U6.7(~{HOLD}) U6.8(VCC) U7.3(~{WP}) U7.7(~{HOLD}) U7.8(VCC)
MISO: U4.2(MISO) U5.2(MISO) U6.2(MISO) U7.2(MISO) ; port MISO
MOSI: U4.5(MOSI) U5.5(MOSI) U6.5(MOSI) U7.5(MOSI) ; port MOSI
PA11_CSMEM3: U7.1(~{CS}) ; port CS3
PA14_CSMEM2: U6.1(~{CS}) ; port CS2
PB10_CSMEM0: U4.1(~{CS}) ; port CS0
PB11_CSMEM1: U5.1(~{CS}) ; port CS1
SCK: U4.6(SCK) U5.6(SCK) U6.6(SCK) U7.6(SCK) ; port SCK  [project net PA13_MEM_SCK]

### Library data of the parts
C4-C7 = CAPACITOR_NP: as C22 on sheet Top; DeviceName: CL10B104KO8NFNC; LibraryName: MF_Passives; DeviceSetName: CAPACITOR_NP; MPN: CL10B104KO8NFNC; URL: https://octopart.com/cl10b104ko8nfnc-samsung-19831587; MF_PARTNUM: CL10B104KO8NFNC
U4-U7 = MT29F2G01ABAGDWB-IT:G TR: IC Flash 2GB (UDFN8); Manufacturer_Name: Micron; SymbolName_1: MT29F2G01ABAGDWB-IT:G TR; DeviceName: IC Flash 2GB (UDFN8); LibraryName: MT29F2G01ABAGDWB-IT:G TR; DeviceSetName: MT29F2G01ABAGDWB-IT:G TR; Manufacturer_Part_Number: MT29F2G01ABAGDWB-IT:G TR; Height: 0.65mm

## Sheet IMU.SchDoc
size A
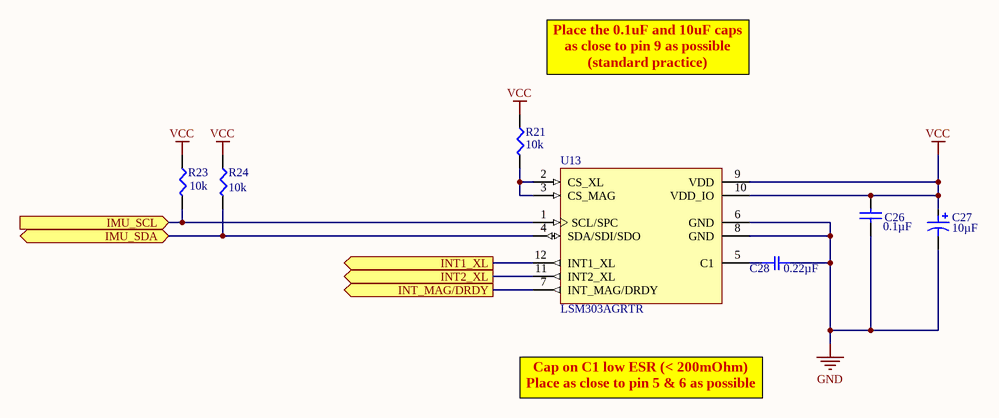
[diagram p4: IMU.SchDoc]

### Parts
C26  Capacitance: 0.1µF  [C0603N]  (hidden comment: CL10B104KO8NFNC)
C27  value 10µF  [2917]  (hidden comment: EEF-CD1B100R)
C28  value 0.22µF  [SMD-0603C]  (hidden comment: GCM188R71E224KA55J)
R21  value 10k  [SMD-0603-RES]  (hidden comment: ERJ-3EKF1002V)
R23  value 10k  [SMD-0603-RES]  (hidden comment: ERJ-3EKF1002V)
R24  value 10k  [SMD-0603-RES]  (hidden comment: ERJ-3EKF1002V)
U13  LSM303AGRTR  [LGA12R50P_200X200X100]

### Ports
IMU_SCL (in), IMU_SDA (bidir), INT1_XL (out), INT2_XL (out), INT_MAG/DRDY (out)

### Nets
GND: C26.1 C27.2 C28.2 U13.6(GND) U13.8(GND)
VCC: C26.2 C27.1 R21.1 R23.1 R24.1 U13.9(VDD) U13.10(VDD_IO)
PA20_IMU_INT1: U13.12(INT1_XL) ; port INT1_XL
PA21_IMU_INT2: U13.11(INT2_XL) ; port INT2_XL
PA22_IMU_SDA: R24.2 U13.4(SDA/SDI/SDO) ; port IMU_SDA
PA23_IMU_SCL: R23.2 U13.1(SCL/SPC) ; port IMU_SCL
PA27_IMU_INTMAG: U13.7(INT_MAG/DRDY) ; port INT_MAG/DRDY
NetC28_1: C28.1 U13.5(C1)
NetR21_2: R21.2 U13.2(CS_XL) U13.3(CS_MAG)

### Notes on the sheet
- Place the 0.1uF and 10uF caps as close to pin 9 as possible (standard practice)
- Cap on C1 low ESR (< 200mOhm)
  Place as close to pin 5 & 6 as possible

### Library data of the parts
C26 = CAPACITOR_NP: as C22 on sheet Top; DeviceName: CL10B104KO8NFNC; LibraryName: MF_Passives; DeviceSetName: CAPACITOR_NP; MPN: CL10B104KO8NFNC; URL: https://octopart.com/cl10b104ko8nfnc-samsung-19831587; MF_PARTNUM: CL10B104KO8NFNC
C27 = CAPACITOR_P: 10µF 12.5V Aluminum Polymer Capacitor 2917 (7343 Metric) 60 mOhm 1000 Hrs @ 105°C; HOUSEPART: NO; POPULATE: 1; TOLERANCE: 20%; DeviceSetName: CAPACITOR_P; MPN: EEF-CD1B100R; URL: https://www.digikey.com/product-detail/en/panasonic-electronic-components/EEF-CD1B100R/PCE3166CT-ND/256706; VOLTAGE: 12.5V
C28 = GCM188R71E224KA55J: CAP CER 0.22UF 25V X7R 0603; Manufacturer: Murata Electronics North America; Factory Stock: 0; Unit Price (USD): 0.1; Minimum Quantity: 1; Tolerance: ±10%; Datasheets: http://www.murata.com/~/media/webrenewal/support/library/catalog/products/capacitor/mlcc/c03e.ashx; Image: //media.digikey.com/Renders/Murata%20Renders/0603%28GCM188%29.jpg; Digi-Key Part Number: 490-8017-1-ND; Part Number: GCM188R71E224KA55J; Quantity Available: 10849; @ qty: 0; Packaging: Cut Tape (CT); Series: GCM; Part Status: Active; Voltage: 25V; Temperature Coefficient: X7R; Operating Temperature: -55°C ~ 125°C; Features: -; Ratings: AEC-Q200; Applications: Automotive; Mounting Type: Surface Mount, MLCC; Package / Case: 0603 (1608 Metric); Size / Dimension: 0.063" L x 0.031" W (1.60mm x 0.80mm); Height - Seated (Max): -; Thickness (Max): 0.035" (0.90mm); Lead Spacing: -; Lead Style: -
R21 R23 R24 = ERJ-3EKF1002V: as R4 on sheet Top; Part Number: ERJ-3EKF1002V; Datasheets: http://industrial.panasonic.com/www-cgi/jvcr13pz.cgi?E+PZ+3+AOA0002+ERJ3EKF1002V+7+WW; Image: //media.digikey.com/Photos/Panasonic%20Photos/MFG_ERJ-P6W%20Series.jpg; Digi-Key Part Number: P10.0KHCT-ND; Quantity Available: 6703141; Packaging: Cut Tape (CT); Series: ERJ; Part Status: Active; Tolerance: ±1%; Composition: Thick Film; Features: Automotive AEC-Q200; Operating Temperature: -55°C ~ 155°C; Package / Case: 0603 (1608 Metric); Supplier Device Package: 0603; Size / Dimension: 0.063" L x 0.031" W (1.60mm x 0.80mm); Height - Seated (Max): 0.022" (0.55mm); Number of Terminations: 2; Failure Rate: -
U13 = CMP-98f6527696964731-1: Ultra-compact high-performance eCompass module: ultra-low power 3D accelerometer and 3D magnetometer; Lifecycle Status: Active; Packaging: Cut Tape (CT); Octopart URL: http://octopart.com/lsm303agrtr-stmicroelectronics-59386630; Manufacturer Part Number: LSM303AGRTR; Case/Package: LGA-12

## Sheet MicroController.SchDoc: SealHAT - SAML21 Microcontroller
size Letter; PageSetup: Record=PageOptions|CenterHorizontal=True|CenterVertical=True|PrintScale=0.94|XCorrection=1.00|YCorrection=1.00|PrintKind=1|BorderSize=5000000|LeftOffset=0|BottomOffset=0|Orientation=2|PaperLength=1000|PaperWidth=1000|Scale=100|PaperSource=7|PrintQuality=-3|MediaType=1|DitherType=10|PrintScaleMode=1|PaperKind=Letter|PaperIndex=1
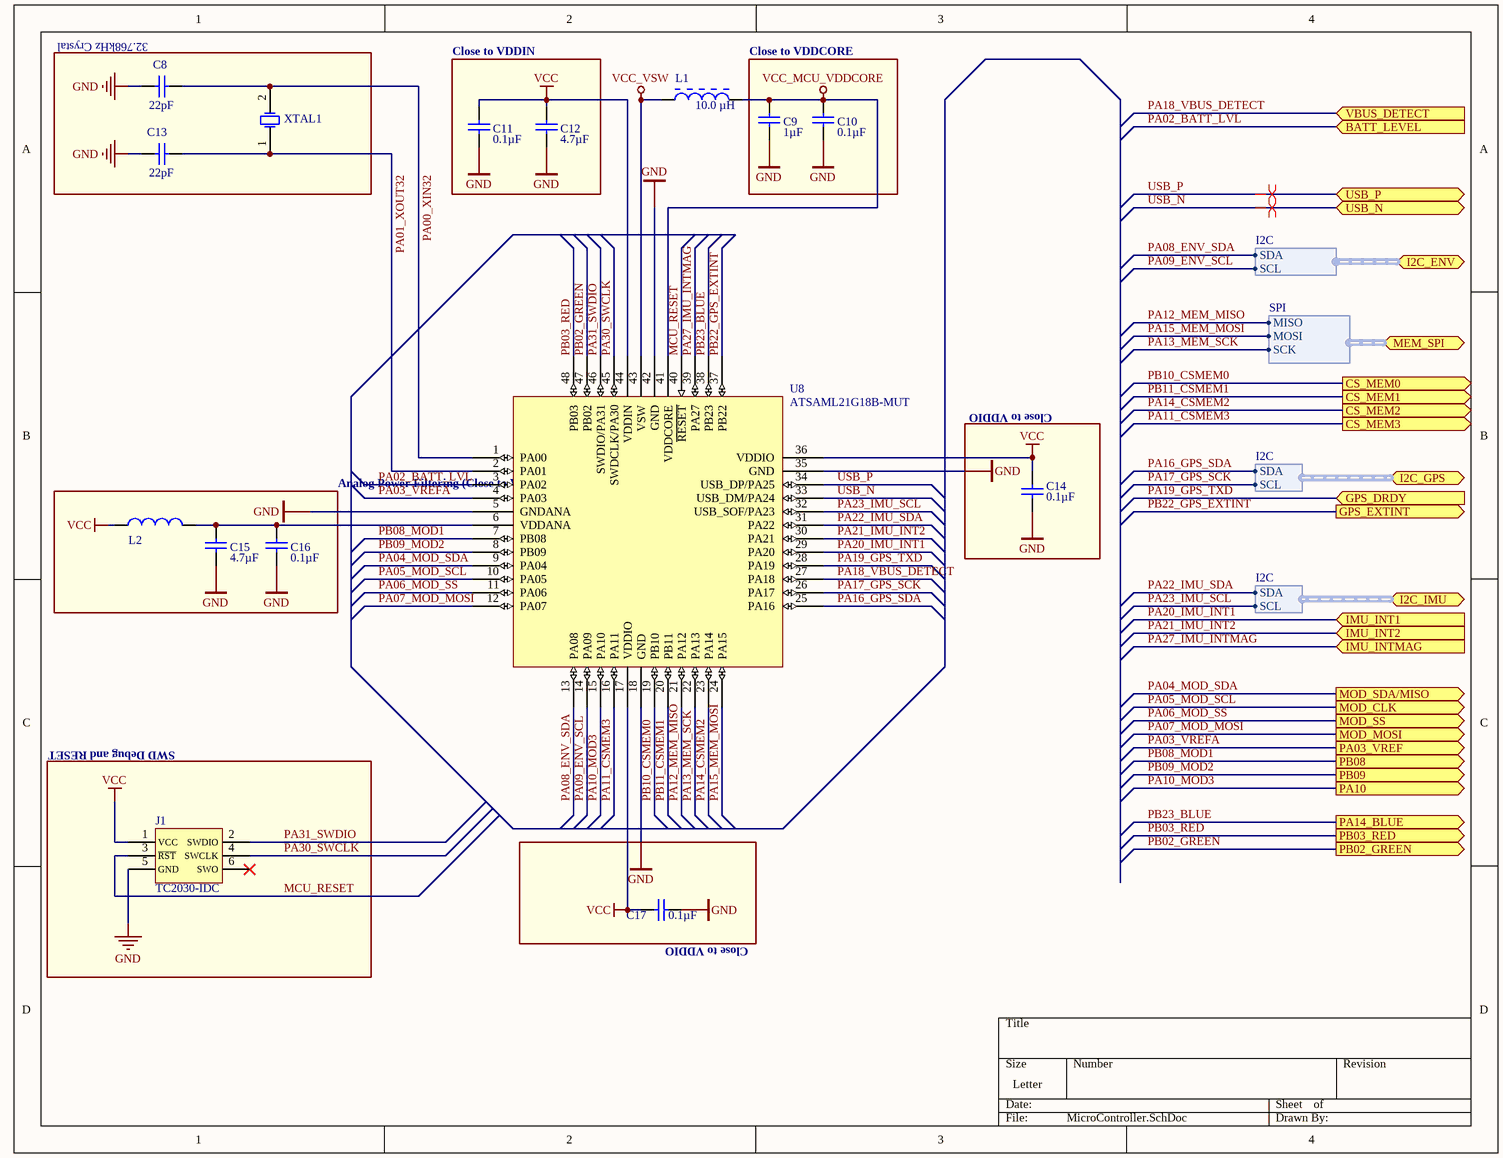
[diagram p5: MicroController.SchDoc]

### Parts
C8  Capacitance: 22pF  [C0402M]  (hidden comment: GRM1555C1H220FA01D)
C9  Capacitance: 1µF  [C0603N]  (hidden comment: CL10B105KP8NFNC)
C10  Capacitance: 0.1µF  [C0603N]  (hidden comment: CL10B104KO8NFNC)
C11  Capacitance: 0.1µF  [C0603N]  (hidden comment: CL10B104KO8NFNC)
C12  Capacitance: 4.7µF  [C0603N]  (hidden comment: C0603C475K8PACTU)
C13  Capacitance: 22pF  [C0402M]  (hidden comment: GRM1555C1H220FA01D)
C14  Capacitance: 0.1µF  [C0603N]  (hidden comment: CL10B104KO8NFNC)
C15  Capacitance: 4.7µF  [C0603N]  (hidden comment: C0603C475K8PACTU)
C16  Capacitance: 0.1µF  [C0603N]  (hidden comment: CL10B104KO8NFNC)
C17  Capacitance: 0.1µF  [C0603N]  (hidden comment: CL10B104KO8NFNC)
J1  TC2030-IDC  [PINHEAD127_1x5]  (no BOM)
L1  Inductance: 10.0 µH  [SRN3015]  (hidden comment: SRN3015-100M)
L2  LI0603G221R-10  [R0603L]  (value not drawn)
U8  ATSAML21G18B-MUT  [QFN50P700X700X90-49N]
XTAL1  FC-135 32.7680KA-A3  [FC-135R$2F$FC-135]  (value not drawn)

### Blocks framed on the sheet
32.768kHz Crystal: C8 C13 XTAL1
Close to VDDIN: C11 C12
Close to VDDCORE: C9 C10
Close to VDDIO: C14
Analog Power Filtering (Close to VDDANA/GNDANA): C15 C16 L2
SWD Debug and RESET: J1
Close to VDDIO: C17

### Ports
BATT_LEVEL (in), CS_MEM0 (out), CS_MEM1 (out), CS_MEM2 (out), CS_MEM3 (out), GPS_DRDY (in), GPS_EXTINT (out), I2C_ENV (harness I2C), I2C_GPS (harness I2C), I2C_IMU (harness I2C), IMU_INT1 (in), IMU_INT2 (in), IMU_INTMAG (in), MEM_SPI (harness SPI), MOD_CLK (out), MOD_MOSI (out), MOD_SDA/MISO (out), MOD_SS (out), PA03_VREF (out), PA10 (out), PA14_BLUE (out), PB02_GREEN (out), PB03_RED (out), PB08 (out), PB09 (out), USB_N (bidir), USB_P (bidir), VBUS_DETECT (in)

### Harnesses
I2C: SDA, SCL
SPI: MOSI, MISO, SCK
I2C: SCL, SDA

### Nets
GND: C8.2 C9.1 C10.2 C11.2 C12.1 C13.2 C14.2 C15.1 C16.2 C17.2 J1.5(GND) U8.5(GNDANA) U8.18(GND) U8.35(GND) U8.42(GND)
VCC: C11.1 C12.2 C14.1 C17.1 J1.1(VCC) L2.1 U8.17(VDDIO) U8.36(VDDIO) U8.44(VDDIN)
VCC_MCU_VDDCORE: C9.2 C10.1 L1.2 U8.41(VDDCORE)
VCC_VSW: L1.1 U8.43(VSW)
MCU_RESET: J1.3(~{RST}) U8.40(~{RESET})
PA00_XIN32: C8.1 U8.1(PA00) XTAL1.2(X2)
PA01_XOUT32: C13.1 U8.2(PA01) XTAL1.1(X1)
PA02_BATT_LVL: U8.3(PA02) ; port BATT_LEVEL  [project net BATLVL]
PA03_VREFA: U8.4(PA03) ; port PA03_VREF
PA04_MOD_SDA: U8.9(PA04) ; port MOD_SDA/MISO
PA05_MOD_SCL: U8.10(PA05) ; port MOD_CLK
PA06_MOD_SS: U8.11(PA06) ; port MOD_SS
PA07_MOD_MOSI: U8.12(PA07) ; port MOD_MOSI
PA08_ENV_SDA: U8.13(PA08) ; port I2C_ENV.SDA
PA09_ENV_SCL: U8.14(PA09) ; port I2C_ENV.SCL
PA10_MOD3: U8.15(PA10) ; port PA10
PA11_CSMEM3: U8.16(PA11) ; port CS_MEM3
PA12_MEM_MISO: U8.21(PA12) ; port MEM_SPI.MISO  [project net MISO]
PA13_MEM_SCK: U8.22(PA13) ; port MEM_SPI.SCK
PA14_CSMEM2: U8.23(PA14) ; port CS_MEM2
PA15_MEM_MOSI: U8.24(PA15) ; port MEM_SPI.MOSI  [project net MOSI]
PA16_GPS_SDA: U8.25(PA16) ; port I2C_GPS.SDA
PA17_GPS_SCK: U8.26(PA17) ; port I2C_GPS.SCL
PA18_VBUS_DETECT: U8.27(PA18) ; port VBUS_DETECT
PA19_GPS_TXD: U8.28(PA19) ; port GPS_DRDY
PA20_IMU_INT1: U8.29(PA20) ; port IMU_INT1
PA21_IMU_INT2: U8.30(PA21) ; port IMU_INT2
PA22_IMU_SDA: U8.31(PA22) ; port I2C_IMU.SDA
PA23_IMU_SCL: U8.32(USB_SOF/PA23) ; port I2C_IMU.SCL
PA27_IMU_INTMAG: U8.39(PA27) ; port IMU_INTMAG
PA30_SWCLK: J1.4(SWCLK) U8.45(SWDCLK/PA30)
PA31_SWDIO: J1.2(SWDIO) U8.46(SWDIO/PA31)
PB02_GREEN: U8.47(PB02) ; port PB02_GREEN
PB03_RED: U8.48(PB03) ; port PB03_RED
PB08_MOD1: U8.7(PB08) ; port PB08
PB09_MOD2: U8.8(PB09) ; port PB09
PB10_CSMEM0: U8.19(PB10) ; port CS_MEM0
PB11_CSMEM1: U8.20(PB11) ; port CS_MEM1
PB22_GPS_EXTINT: U8.37(PB22) ; port GPS_EXTINT
PB23_BLUE: U8.38(PB23) ; port PA14_BLUE
USB_N: U8.33(USB_DM/PA24) ; port USB_N
USB_P: U8.34(USB_DP/PA25) ; port USB_P
NetC15_2: C15.2 C16.1 L2.2 U8.6(VDDANA)

Not connected (* = marked no-connect by the designer): J1 6(SWO)*

### Layout directives
differential pair: USB_N, USB_P

### Library data of the parts
C8 C13 = CAPACITOR_NP: CAP CER 22PF 50V C0G/NP0 0402; HOUSEPART: NO; POPULATE: 1; TOLERANCE: ±1%; Temperature Coefficient: X5R; DeviceName: GRM1555C1H220FA01D; LibraryName: MF_Passives; DeviceSetName: CAPACITOR_NP; MPN: GRM1555C1H220FA01D; URL: https://octopart.com/grm1555c1h220fa01d-murata-21524193; VOLTAGE: 50V; MF_PARTNUM: GRM1555C1H220FA01D
C9 = CAPACITOR_NP: as C1 on sheet Environmental; DeviceName: CL10B105KP8NFNC; LibraryName: MF_Passives; DeviceSetName: CAPACITOR_NP; MPN: CL10B105KP8NFNC; URL: https://octopart.com/cl10b104ko8nfnc-samsung-19831587; MF_PARTNUM: CL10B105KP8NFNC; Temperature Coefficient: X7R
C10 C11 C14 C16 C17 = CAPACITOR_NP: as C22 on sheet Top; DeviceName: CL10B104KO8NFNC; LibraryName: MF_Passives; DeviceSetName: CAPACITOR_NP; MPN: CL10B104KO8NFNC; URL: https://octopart.com/cl10b104ko8nfnc-samsung-19831587; MF_PARTNUM: CL10B104KO8NFNC
C12 C15 = CAPACITOR_NP: CAP CER 1UF 10V X7R 0603; HOUSEPART: NO; POPULATE: 1; TOLERANCE: ±10%; Temperature Coefficient: X5R; DeviceName: C0603C475K8PACTU; LibraryName: MF_Passives; DeviceSetName: CAPACITOR_NP; MPN: C0603C475K8PACTU; URL: https://octopart.com/c0603c475k8pactu-kemet-9145152; VOLTAGE: 10V; MF_PARTNUM: C0603C475K8PACTU
J1 = TC2030-IDC-NL: CABLE ADAPTER 6 POS; Manufacturer: Tag-Connect LLC; Manufacturer Part Number: TC2030-IDC; hyperlink: https://www.digikey.com/product-detail/en/tag-connect-llc/TC2030-IDC/TC2030-IDC-ND/4571121
L1 = CMP-911278-2: Semi-shielded Power Inductor, 10 uH, +/- 20%, 1 A, -40 to 125 degC, 3 x 3 x 1.5 mm SMD, RoHS and Halogen Free, Tape and Reel; Self Resonant Frequency: 45000000.0 Hz; Number of Pins: 2; Octopart Url: https://octopart.com/srn3015-100m-bourns-20579191; OctopartID: 45668d5663779aa1; Packaging: Tape & Reel (TR); REACH SVHC Compliance: No SVHC; RoHS: Compliant; Manufacturer Part Number: SRN3015-100M
L2 = INDUCTOR: HOUSEPART: NO; POPULATE: 1; LibraryName: MF_Passives; DeviceSetName: INDUCTOR; MPN: LI0603G221R-10; URL: https://www.digikey.com/product-detail/en/laird-signal-integrity-products/LI0603G221R-10/240-2368-1-ND/806728
U8 = ATSAML21G18B-MUT: RAM Memory Size: 32768 B; Octopart URL: https://octopart.com/atsaml21g18b-mut-microchip-77761695; RoHS: Compliant; OctopartID: 3cd3f17b952ae314; Manufacturer Part Number: ATSAML21G18B-MUT
XTAL1 = FC-13532.7680KA-A3: FC-135 Series 32.768 KHz ±20 ppm 12.5 pF -40 to +85°C Surface Mount Crystal; manufacturer: epson; Octopart URL: https://octopart.com/fc-135+32.7680ka-a3-epson-39545807; Manufacturer Part Number: FC-135 32.7680KA-A3; Case/Package: FC-135

## Nets that join several sheets
GND: Top (20 pins), Environmental (6 pins), GPS (12 pins), Memory (8 pins), IMU (5 pins), MicroController (15 pins)
VCC: Top (7 pins), Environmental (6 pins), GPS (8 pins), Memory (16 pins), IMU (7 pins), MicroController (9 pins)
BATLVL: Top (R6.2 R7.1), MicroController (U8.3)
MISO: Top (TP-MISO1.1), Memory (U4.2 U5.2 U6.2 U7.2), MicroController (U8.21)
MOSI: Top (TP-MOSI1.1), Memory (U4.5 U5.5 U6.5 U7.5), MicroController (U8.24)
PA03_VREFA: Top (J6.1), MicroController (U8.4)
PA04_MOD_SDA: Top (J5.1), MicroController (U8.9)
PA05_MOD_SCL: Top (J5.2), MicroController (U8.10)
PA06_MOD_SS: Top (J5.3), MicroController (U8.11)
PA07_MOD_MOSI: Top (J5.4), MicroController (U8.12)
PA08_ENV_SDA: Top (TP-SDA1.1), Environmental (R1.1 U1.6 U2.1), MicroController (U8.13)
PA09_ENV_SCL: Top (TP-SCL1.1), Environmental (R2.1 U1.5 U2.6), MicroController (U8.14)
PA10_MOD3: Top (J6.4), MicroController (U8.15)
PA11_CSMEM3: Memory (U7.1), MicroController (U8.16)
PA13_MEM_SCK: Top (TP-SCK1.1), Memory (U4.6 U5.6 U6.6 U7.6), MicroController (U8.22)
PA14_CSMEM2: Memory (U6.1), MicroController (U8.23)
PA16_GPS_SDA: Top (TP-SDA2.1), GPS (R20.2 U12.9), MicroController (U8.25)
PA17_GPS_SCK: Top (TP-SCK2.1), GPS (R19.2 U12.12), MicroController (U8.26)
PA18_VBUS_DETECT: Top (R9.1 R11.2), MicroController (U8.27)
PA19_GPS_TXD: Top (TP_DRDY1.1), GPS (L4.1), MicroController (U8.28)
PA20_IMU_INT1: Top (TP_INT1.1), IMU (U13.12), MicroController (U8.29)
PA21_IMU_INT2: Top (TP_INT2.1), IMU (U13.11), MicroController (U8.30)
PA22_IMU_SDA: Top (TP_SDA1.1), IMU (R24.2 U13.4), MicroController (U8.31)
PA23_IMU_SCL: Top (TP_SCL1.1), IMU (R23.2 U13.1), MicroController (U8.32)
PA27_IMU_INTMAG: Top (TP_MAGINT1.1), IMU (U13.7), MicroController (U8.39)
PB02_GREEN: Top (R17.2), MicroController (U8.47)
PB03_RED: Top (R16.2), MicroController (U8.48)
PB08_MOD1: Top (J6.2), MicroController (U8.7)
PB09_MOD2: Top (J6.3), MicroController (U8.8)
PB10_CSMEM0: Memory (U4.1), MicroController (U8.19)
PB11_CSMEM1: Memory (U5.1), MicroController (U8.20)
PB22_GPS_EXTINT: Top (TP_EXTINT1.1), GPS (U12.19), MicroController (U8.37)
PB23_BLUE: Top (R18.2), MicroController (U8.38)
USB_N: Top (U10.3 USB1.2), MicroController (U8.33)
USB_P: Top (U10.2 USB1.3), MicroController (U8.34)